# EAGLE design AudioReceiver (EAGLE 7.5.0)
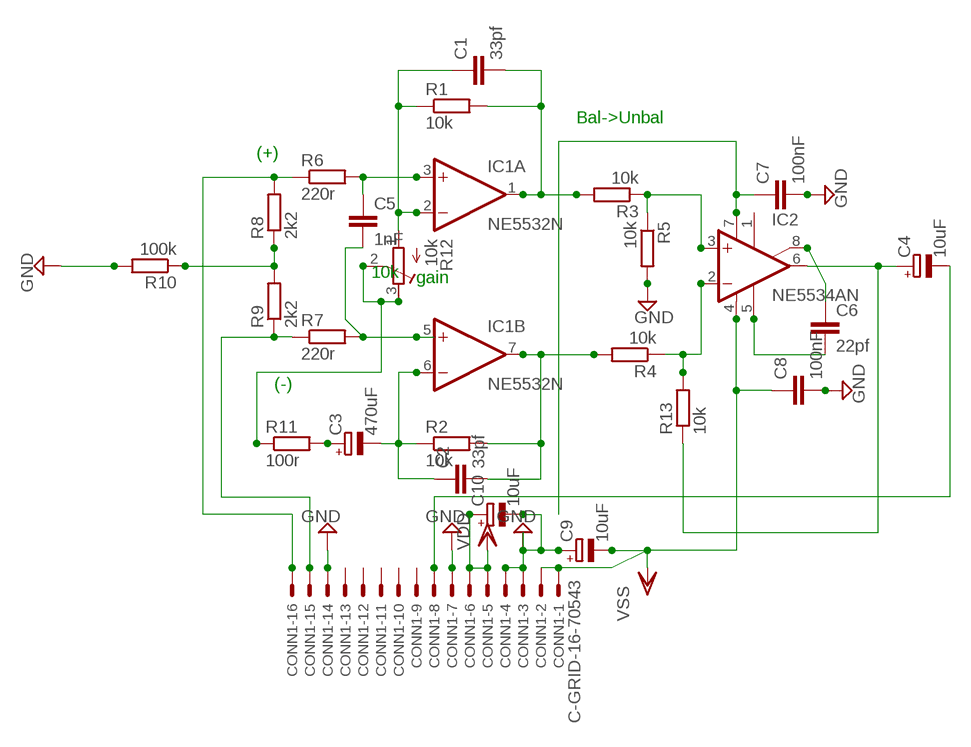
[diagram p0: schematic, sheet 1]

## Parts
C1  33pf  C2.5/2  [C2.5-2]
C2  33pf  C2.5/2  [C2.5-2]
C3  470uF  CPOL-EUE5-10.5  [E5-10,5]
C4  10uF  CPOL-EUE2.5-5  [E2,5-5]
C5  1nF  C5/2.5  [C5B2.5]
C6  22pf  C2.5/2  [C2.5-2]
C7  100nF  C5/2.5  [C5B2.5]
C8  100nF  C5/2.5  [C5B2.5]
C9  10uF  CPOL-EUE2.5-5  [E2,5-5]
C10  10uF  CPOL-EUE2.5-5  [E2,5-5]
CONN1  C-GRID-16-70543  [70543-16]
IC1  NE5532N  [DIL08]
IC2  NE5534AN  [DIL08]
R1  10k  R-EU_0204/7  [0204/7]
R2  10k  R-EU_0204/7  [0204/7]
R3  10k  R-EU_0204/7  [0204/7]
R4  10k  R-EU_0204/7  [0204/7]
R5  10k  R-EU_0204/7  [0204/7]
R6  220r  R-EU_0204/7  [0204/7]
R7  220r  R-EU_0204/7  [0204/7]
R8  2k2  R-EU_0204/7  [0204/7]
R9  2k2  R-EU_0204/7  [0204/7]
R10  100k  R-EU_0204/7  [0204/7]
R11  100r  R-EU_0204/7  [0204/7]
R12  10k  R-TRIMM64P  [RTRIM64P]
R13  10k  R-EU_0204/7  [0204/7]

## Nets
GND: C7.2 C8.2 C9.+ C10.- CONN1.3 CONN1.4 CONN1.7 CONN1.14 R5.2 R10.2
N$1: C5.1 IC1.3(A:+IN) R6.2
N$2: C6.1 IC2.8(ON/CMP)
N$3: C1.2 IC1.1(A:OUT) R1.2 R3.2
N$4: C2.2 IC1.7(B:OUT) R2.2 R4.2
N$5: C1.1 IC1.2(A:-IN) R1.1 R12.1(A)
N$6: C2.1 C3.- IC1.6(B:-IN) R2.1
N$7: C3.+ R11.2
N$8: IC2.3(+IN) R3.1 R5.1
N$9: R11.1 R12.2(S) R12.3(E)
N$10: CONN1.15 R7.1 R9.1
N$11: CONN1.16 R6.1 R8.2
N$12: R8.1 R9.2 R10.1
N$13: C5.2 IC1.5(B:+IN) R7.2
N$14: IC2.2(-IN) R4.1 R13.2
N$15: C4.+ IC2.6(OUT) R13.1
N$16: C6.2 IC2.5(CMP)
OUT: C4.- CONN1.8
V+: C7.1 C10.+ CONN1.5 CONN1.6 IC2.7(V+) ; supply symbol labelled VDD
V-: C8.1 C9.- CONN1.1 CONN1.2 IC2.4(V-) ; supply symbol labelled VSS
Unconnected: CONN1.9 CONN1.10 CONN1.11 CONN1.12 CONN1.13 IC2.1(ON)

## Notes on the sheet
- Bal->Unbal
- (+)
- gain
- (-)

## Power pins joined to a net without a drawn wire
V+: IC1.8(P:V+)
V-: IC1.4(P:V-)

## Library data of the parts
C1 C2 C5-C8 = capacitor-wima:C: CAPACITOR naming: grid - package width
C3 C4 = rcl:CPOL-EU: POLARIZED CAPACITOR, European symbol
C9 C10 = resistor:CPOL-EU: POLARIZED CAPACITOR, European symbol
CONN1 = con-molex:C-GRID-16: CONNECTOR wire to board 2.54 mm (0.100") pitch header; OC_FARNELL: unknown; OC_NEWARK: unknown
IC1 = linear:NE5532: AUDIO AMPLIFIER
IC2 = linear:NE5534: LOW-NOISE OPERATIONAL AMPLIFIER Source: http://focus.ti.com/lit/ds/symlink/ne5534.pdf
R1-R11 R13 = resistor:R-EU_: RESISTOR, European symbol
R12 = resistor:R-TRIMM: Trimm resistor; TRIM1: 10k

## Net classes
0 default: clearance 0.205 mm

## Board
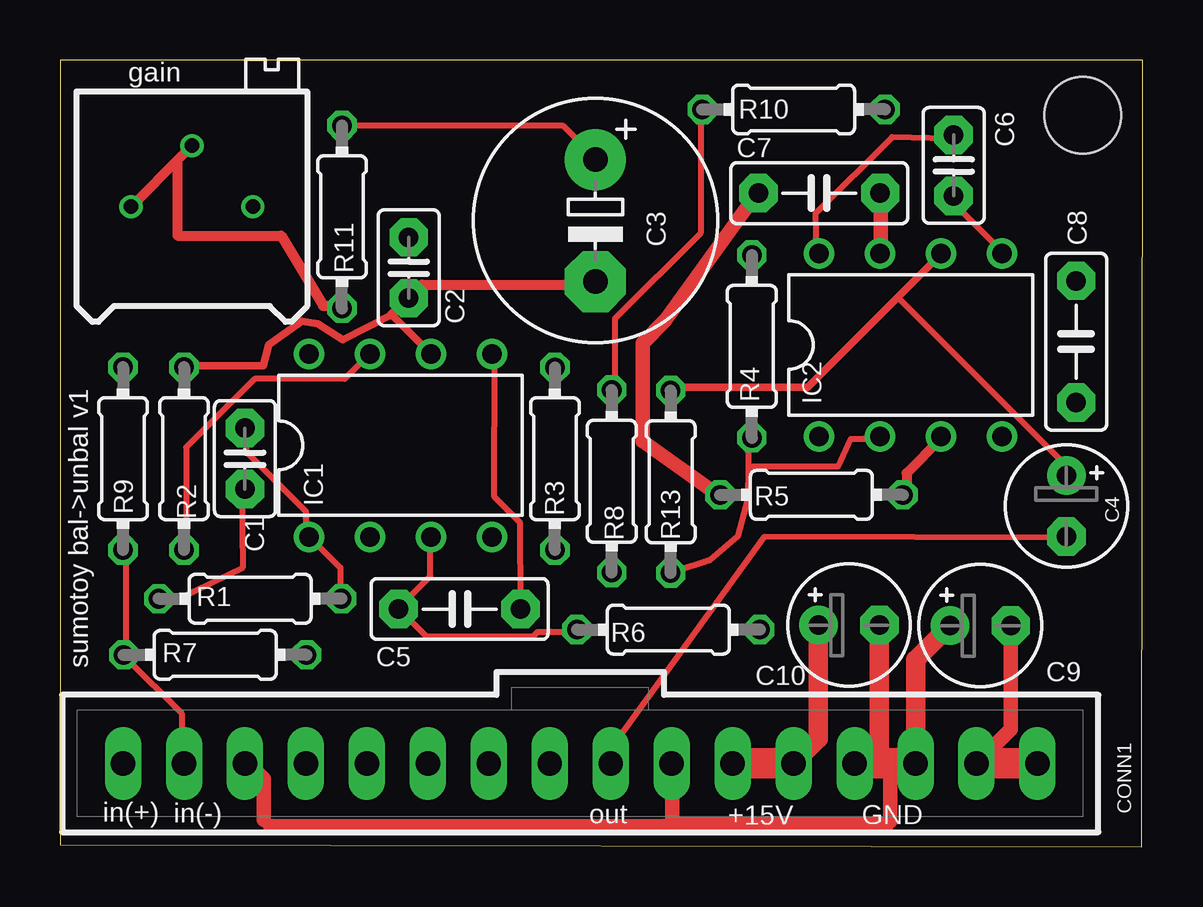
[diagram p1: board, top side]
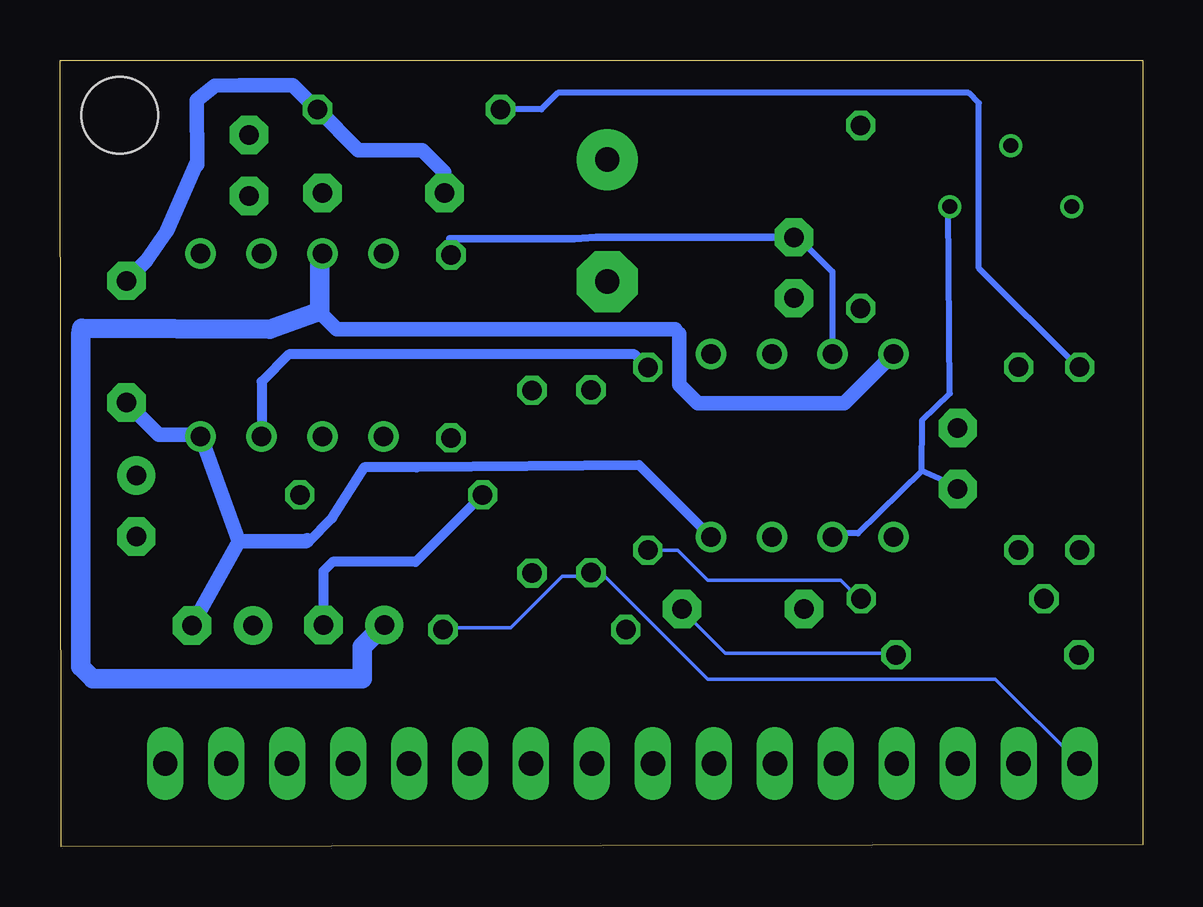
[diagram p2: board, bottom side, seen from below]

Size 45.11 x 32.78 mm. Coordinates in mm from the lower left corner, seen from the top.
Outline: 0,0.07 45.07,0 45.11,32.78 0,32.76 0,0.07
Copper layers (1*16): Top 0.0356mm / dielectric 1.5011mm / Bottom 0.0356mm
Design rules "OSHpark": minimum track width 6mil, minimum drill 13mil, track to track 6mil, track to pad 6mil, pad to pad 6mil, via to via 6mil, smd to smd 6mil, copper to edge 15mil, drill to drill 6mil, minimum pad ring 7mil, minimum via ring 7mil, stop-mask expansion 3mil, vias tented up to drill 0mil, thermal gap 10mil
Holes 3.2 mm at 42.62,30.47

### Footprints (pad centres in the part's own frame; a part is rotated, then mirrored left to right if it is on the bottom)
C2.5-2 = drill 0.813 pad 1.6 octagon: 1 -1.27,0; 2 1.27,0
E5-10,5 = drill 1.016 pad 2.54: + -2.54,0 | drill 1.016 pad 2.54 octagon: - 2.54,0
E2,5-5 = drill 0.813 pad 1.6: + -1.27,0 | drill 0.813 pad 1.6 octagon: - 1.27,0
C5B2.5 = drill 0.813 pad 1.6 octagon: 1 -2.54,0; 2 2.54,0
70543-16 = drill 1.016 long: 1 -19.05,0; 2 -16.51,0; 3 -13.97,0; 4 -11.43,0; 5 -8.89,0; 6 -6.35,0; 7 -3.81,0; 8 -1.27,0; 9 1.27,0; 10 3.81,0; 11 6.35,0; 12 8.89,0; 13 11.43,0; 14 13.97,0; 15 16.51,0; 16 19.05,0
DIL08 = drill 0.813 pad 1.27: 1 -3.81,-3.81; 2 -1.27,-3.81; 3 1.27,-3.81; 4 3.81,-3.81; 5 3.81,3.81; 6 1.27,3.81; 7 -1.27,3.81; 8 -3.81,3.81
0204/7 = drill 0.813 octagon: 1 -3.81,0; 2 3.81,0
RTRIM64P = drill 0.61: 1 0,-2.54; 2 2.54,0; 3 0,2.54

### Placement (x,y rotation side)
C1  7.71,16.16 90 top
C2  14.53,24.12 90 top
C3  22.31,26.08 270 top
C4  41.93,14.19 270 top
C5  16.65,9.9 0 top
C6  37.24,28.38 270 top
C7  31.64,27.23 180 top
C8  42.34,21.04 90 top
C9  38.35,9.21 0 top
C10  32.87,9.23 0 top
CONN1  21.68,3.46 180 top
IC1  14.18,16.72 0 top
IC2  35.44,20.9 0 top
R1  7.92,10.33 0 top
R2  5.17,16.16 270 top
R3  20.62,16.16 270 top
R4  28.82,20.84 90 top
R5  31.31,14.66 180 top
R6  25.35,9.04 180 top
R7  6.47,7.99 0 top
R8  22.99,15.22 270 top
R9  2.63,16.16 90 top
R10  30.57,30.72 0 top
R11  11.75,26.24 90 top
R12  5.5,26.67 90 top
R13  25.44,15.2 270 top

### Tracks (layer width: path | path; a pad name or v marks a point on that pad's centre or on a via)
GND
  Top 0.152: 27.41,14.67 R5.2 | 29.02,27.17 C7.2
  Top 0.254: 7.77,3.56 CONN1.14
  Top 0.406: 25.67,3.56 25.5,3.39 | 25.5,0.85 25.59,0.94 | 34.47,0.94 34.59,1.07 | 8.5,1.12 8.76,0.85 | 34.59,3.46 34.14,3.92
  Top 0.61: 25.67,3.56 CONN1.7 | 25.5,3.39 25.5,0.85 8.76,0.85 | 25.59,0.94 34.47,0.94 | 34.59,1.07 34.59,3.46 | 7.77,3.56 8.5,2.83 8.5,1.12 | 27.41,14.67 24.29,16.89 24.27,20.98 25.23,21.92 29.02,27.17
  Top 0.813: 34.14,3.92 C10.- | C9.+ 35.65,7.78 CONN1.3
  Top 1.27: CONN1.3 34.59,3.46 CONN1.4
  Bottom 0.406: 39.41,28.5 39.39,28.42 | 34.41,30.72 R10.2 | R5.2 30.29,11.87 33.75,11.87 34.14,11.48 C10.-
  Bottom 0.61: C8.2 41.51,24.41 40.66,25.63 39.41,28.5 | 39.39,28.42 39.41,31.09 38.66,31.71 37.62,31.72 35.41,31.72 34.41,30.72 | R10.2 32.68,29.02 30.03,29.02 29.1,28.09 C7.2
N$1
  Top 0.254: R6.2 21.51,8.95 19.9,8.95 19.72,8.77 15.26,8.77 14.18,9.84 C5.1 14.18,10.02 15.44,11.27 15.44,12.88 IC1.3
N$2
  Top 0.152: 37.06,29.5 C6.1
  Top 0.254: 37.06,29.5 34.67,29.56 31.47,26.36 31.51,24.83 IC2.8
N$3
  Top 0.152: 7.75,17.35 C1.2
  Top 0.254: R1.2 11.68,10.38 11.68,11.63 10.43,12.88 IC1.1 10.25,13.06 10.25,13.95 7.75,16.45 7.75,17.35
  Bottom 0.152: R3.2 20.62,12.34 19.37,12.34 18.12,11.09 12.58,11.09 11.86,10.38 R1.2
N$4
  Top 0.254: R2.2 5.25,12.52 5.25,16.63 8.11,19.49 11.86,19.49 12.76,20.38 IC1.7
  Bottom 0.152: 14.54,25.39 C2.2 | 12.93,20.56 IC1.7
  Bottom 0.254: 12.93,20.56 12.93,23.96 14.36,25.39 C2.2
  Bottom 0.305: 14.54,25.39 22.76,25.39 23.68,25.33 28.87,25.33 R4.2
N$5
  Top 0.254: R1.1 4.18,10.38 4.99,10.36 7.61,11.62 7.57,14.84 C1.1
  Bottom 0.254: 9.21,15.67 9.19,17.76 8.03,18.87 8.11,26.64 R12.1 | 9.21,15.67 7.75,15.02 C1.1 | 9.21,15.67 11.86,13.06 12.76,13.06 IC1.2
N$6
  Top 0.152: 5.25,20.03 R2.1 | 15.44,20.56 IC1.6 | 22.23,23.42 C3.- | 14.54,22.89 C2.1
  Top 0.305: 5.25,20.03 8.47,20.03 8.71,20.91 10.07,21.9 10.74,21.78 11.78,21.11 13.83,22.17 15.44,20.56
  Top 0.406: 13.83,22.17 14.36,22.71 C2.1 | 22.23,23.42 15.08,23.42 14.54,22.89
N$7
  Top 0.254: R11.2 11.86,30.03 20.98,30.03 22.23,28.78 C3.+
N$8
  Top 0.406: R5.1 35.27,14.67 35.27,15.56 36.7,16.99 IC2.3
  Bottom 0.406: R3.1 21.16,20.52 35.58,20.52 36.71,19.38 IC2.3
N$9
  Top 0.152: 3.11,26.82 R12.3 | 5.43,29.14 R12.2 | 11.68,22.53 R11.1
  Top 0.406: 5.43,29.14 4.89,28.6 | 4.89,28.6 3.11,26.82 | 11.68,22.53 10.97,22.53 9.21,25.46 4.89,25.46 4.89,28.6
N$10
  Top 0.152: 2.75,7.87 R7.1
  Top 0.254: R7.1 2.75,8.05 2.75,12.34 R9.1 | 2.75,7.87 5.07,5.55 5.07,3.59 CONN1.15
N$11
  Bottom 0.152: R6.1 29.02,9.13 26.34,9.13 24.19,11.27 23.12,11.27 R8.2 22.94,11.27 22.4,11.27 18.12,6.98 6.14,6.98 CONN1.16
N$12
  Top 0.254: R8.1 23.12,19.13 23.12,21.99 26.69,25.57 26.69,30.57 R10.1
  Bottom 0.152: 2.75,20.03 R9.2
  Bottom 0.254: 26.69,30.57 R10.1 25.06,30.72 24.36,31.41 7.25,31.41 6.82,30.98 6.82,24.1 2.75,20.03
N$13
  Top 0.254: IC1.5 18.12,20.38 18.1,14.58 19.17,13.5 19.19,10.02 C5.2
  Bottom 0.152: R7.2 10.43,8.05 17.4,8.05 19.19,9.84 C5.2
N$14
  Top 0.254: 28.68,15.85 28.66,16.99 R4.1 | 28.68,15.85 28.66,14.49 28.25,12.93 27.07,11.92 25.62,11.45 R13.2 | 28.68,15.85 32.43,15.85 32.95,16.99 34.02,16.99 IC2.2
N$15
  Top 0.254: 34.91,22.89 41.88,15.92 41.88,15.56 C4.+
  Top 0.305: R13.1 25.62,19.13 31.16,19.13 34.91,22.89 36.7,24.67 IC2.6
N$16
  Top 0.254: IC2.5 39.2,24.85 37.06,27 C6.2
OUT
  Top 0.152: 41.88,12.88 C4.-
  Top 0.254: 41.88,12.88 29.35,12.91 23.12,4.3 23.12,3.59 CONN1.8
V+
  Top 0.61: C7.1 34.2,27.17 34.2,24.85 IC2.7
  Top 0.813: CONN1.5 31.6,4.5 C10.+
  Top 1.27: CONN1.5 CONN1.6
  Bottom 0.254: 19.31,21.38 19.48,21.55 | 34.29,22.27 34.29,22.31
  Bottom 0.406: IC2.7 34.29,24.6
  Bottom 0.61: IC1.8 12.44,18.47 18.54,18.47 19.31,19.24 19.31,21.38 | 19.48,21.55 33.57,21.55 34.29,22.27
  Bottom 0.813: 34.29,24.6 34.29,22.31 36.37,21.55 44.2,21.59 44.25,21.34 44.25,7.49 43.75,6.99 32.51,6.99 32.51,8.32 C10.+
V-
  Top 0.61: CONN1.2 39.62,4.89 C9.-
  Top 1.27: CONN1.1 CONN1.2
  Bottom 0.152: 39.2,16.99 IC2.4
  Bottom 0.406: IC1.4 20.98,15.9 30.25,15.8 32.44,15.8 33.78,13.68 34.79,12.66 37.66,12.73 | 37.65,12.75 34.86,12.73
  Bottom 0.61: IC2.4 39.38,17.17 40.99,17.17 42.24,18.42 C8.1 | 34.81,12.76 34.86,12.73 37.66,12.73 39.2,16.99 | C9.- 37.65,12.75

### Text on the board
tNames: gain | sumotoy bal->unbal v1 | in(+) | in(-) | out | +15V | GND
tValues: -15V